# EasyEDA Pro project Atmega328p Shift Register.eprj

# Schematic Schematic1
Board Name: Board1; Create Date: 2025-01-31; Page Name: P1; Project Name: Arduino Nano Shift Register; Schematic Name: Schematic1; Update Date: 2025-01-30; Company: EasyEDA.com; Page Size: A4; Version: V1.0
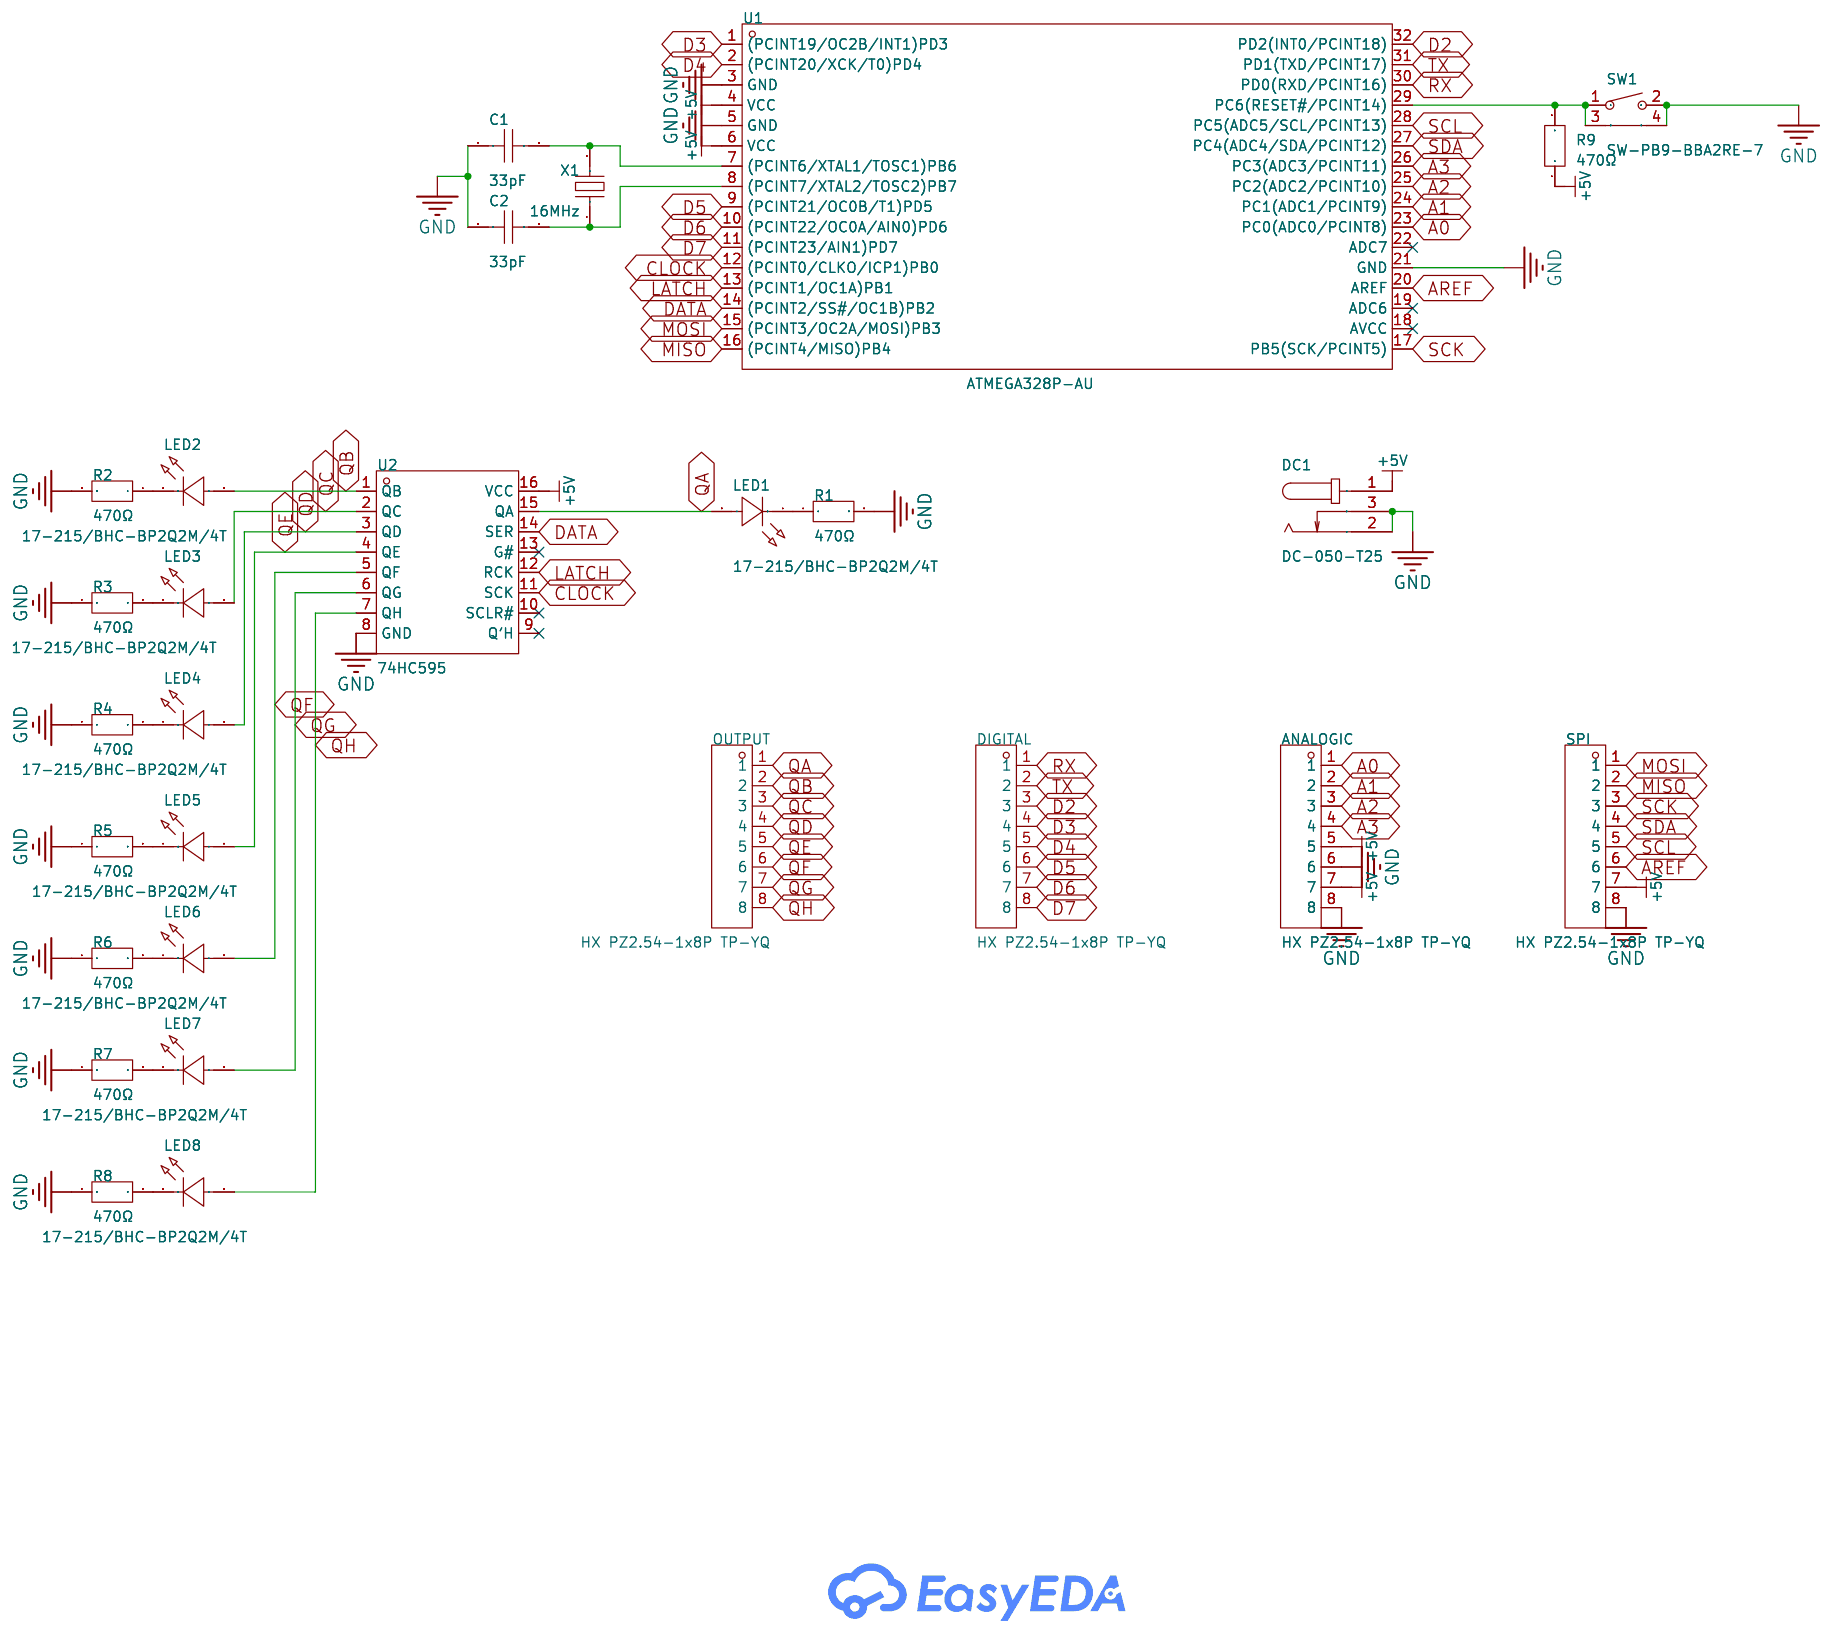
[diagram p0: schematic sheet]

## Parts
ANALOGIC  HX PZ2.54-1x8P TP-YQ  [HDR-SMD_8P-P2.54-V-M-LS4.8_XKB_R1]
C1  33pF  [C0603]
C2  33pF  [C0603]
DC1  DC-050-T25  [DC-IN-SMD_DC-050-T25]
DIGITAL  HX PZ2.54-1x8P TP-YQ  [HDR-SMD_8P-P2.54-V-M-LS4.8_XKB_R1]
LED1  17-215/BHC-BP2Q2M/4T  [LED0805-RD]
LED2  17-215/BHC-BP2Q2M/4T  [LED0805-RD]
LED3  17-215/BHC-BP2Q2M/4T  [LED0805-RD]
LED4  17-215/BHC-BP2Q2M/4T  [LED0805-RD]
LED5  17-215/BHC-BP2Q2M/4T  [LED0805-RD]
LED6  17-215/BHC-BP2Q2M/4T  [LED0805-RD]
LED7  17-215/BHC-BP2Q2M/4T  [LED0805-RD]
LED8  17-215/BHC-BP2Q2M/4T  [LED0805-RD]
OUTPUT  HX PZ2.54-1x8P TP-YQ  [HDR-SMD_8P-P2.54-V-M-LS4.8_XKB_R1]
R1  470Ω  [R0805]
R2  470Ω  [R0805]
R3  470Ω  [R0805]
R4  470Ω  [R0805]
R5  470Ω  [R0805]
R6  470Ω  [R0805]
R7  470Ω  [R0805]
R8  470Ω  [R0805]
R9  470Ω  [R0805]
SPI  HX PZ2.54-1x8P TP-YQ  [HDR-SMD_8P-P2.54-V-M-LS4.8_XKB_R1]
SW1  SW-PB9-BBA2RE-7  [SW-SMD_SW-PB9-BBA2RE-7]
U1  ATMEGA328P-AU  [TQFP-32_L7.0-W7.0-P0.80-LS9.0-BL]
U2  74HC595  [SOP-16_L9.9-W3.9-P1.27-LS6.0-BL]
X1  16MHz  [HC-49S_L7.0-W4.0-LS8.0]

## Library data of the parts
ANALOGIC DIGITAL OUTPUT SPI = HX PZ2.54-1x8P TP-YQ: LCSC Part Name: 1x8P 间距:2.54mm 方针 立贴; Supplier Part: C41417365; Manufacturer: hanxia(韩下); Supplier Footprint: SMD,P=2.54mm(交错脚); Datasheet: https://atta.szlcsc.com/upload/public/pdf/source/20240927/D9736A64A8D4E11D9DE5C9D94414317B.pdf; Supplier: LCSC; Pin Structure: 1x8P; Pitch: 2.54mm; Circluar Pins/Square Pins: Policy; Mounting Type: Standing paste; Number of Rows: Single Row; Number of Pins: 8P; Rated Current: 3A; Length of Mating Pin: 6mm; Insulation Height: 2.5mm; Contact Plating: Gold; Operating Temperature: -40℃~+105℃; Color: Black
C1 C2 = C0603C330J8GAC7867: LCSC Part Name: 33pF ±5% 10V; Supplier Part: C3881472; Manufacturer: KEMET(基美); Supplier Footprint: 0603; JLCPCB Part Class: Extended Part; Datasheet: https://atta.szlcsc.com/upload/public/pdf/source/20231023/C0402C681F5GAC7867-e974561de8c2c410bc948341e1392a66.pdf; Supplier: LCSC; Tolerance: ±5%
DC1 = DC-050-T25: Supplier Part: C113716; Manufacturer: SOFNG(硕方); Supplier Footprint: SMD; Datasheet: https://atta.szlcsc.com/upload/public/pdf/source/20241205/2A515B297B2D6AED9E5FA390EA3E3387.pdf; Supplier: LCSC; Current Rating (Max): 3A; Voltage Rating (Max): 12V
LED1-LED8 = 17-215/BHC-BP2Q2M/4T: Supplier Part: C19192157; Manufacturer: EVERLIGHT(亿光); Supplier Footprint: 0805; JLCPCB Part Class: Extended Part; Supplier: LCSC; Illumination Color: Blue; Power(Watts): 95mW; Wavelength - Dominant: 467.5nm~473.5nm; Lens Color: Colorless Transparent Lens; Luminous Intensity: 57mcd~112mcd; Viewing Angle: 130°; Operating Temperature: -40℃~+85℃
R1-R9 = RC2012F471CS: LCSC Part Name: 厚膜电阻 470Ω ±1% 125mW; Supplier Part: C4190682; Manufacturer: SAMSUNG(三星); Supplier Footprint: 0805; JLCPCB Part Class: Extended Part; Datasheet: https://atta.szlcsc.com/upload/public/pdf/source/20210602/455D0E07AED06E76D0C921B8CB06E528.pdf; Supplier: LCSC; Type: Thick Film Resistors; Tolerance: ±1%; Temperature Coefficient: ±100ppm/℃; Operating Temperature: -55℃~+155℃
SW1 = SW-PB9-BBA2RE-7: Supplier Part: C6241509; Manufacturer: ADAM TECH; JLCPCB Part Class: Extended Part; Datasheet: https://atta.szlcsc.com/upload/public/pdf/source/20240419/E6DD6FA39A8FB5D62685F946C05F7AED.pdf; Supplier: LCSC
U1 = ATMEGA328P-AU_C14877: LCSC Part Name: 基于AVR增强型RISC架构的低功耗CMOS 8位微控制器; Supplier Part: C14877; Manufacturer: MICROCHIP(美国微芯); Supplier Footprint: TQFP-32(7x7); JLCPCB Part Class: Extended Part; Datasheet: https://atta.szlcsc.com/upload/public/pdf/source/20140621/1457707095197.pdf; Supplier: LCSC; CPU Core: AVR; Program Storage Size: 32KB; RAM Size: 2KB; GPIO Ports Number: 23; Operating Voltage Range: 1.8V~5.5V; CPU Maximum Speed: 20MHz; Program Memory Type: FLASH; EEPROM: 1KB; Operating Temperature Range: -40℃~+85℃; ADC (Bit): 10bit; Peripheral/Function: WDT；PWM；WDT；PWM; Watchdog: 有; Low-Voltage Detect: 有; Internal Oscillator: 有
U2 = 74HC595: Supplier Part: C18164493; Manufacturer: GR(国睿); Supplier Footprint: SOP-16; Datasheet: https://atta.szlcsc.com/upload/public/pdf/source/20230915/F264A7C02E418D1689E15579DAA93EB8.pdf; Supplier: LCSC; Function: Serial to serial or parallel; Supply Voltage: 2V~6V; Number of Elements: 1; Number of Bits per Element: 8; Output Type: Tri-State; Operating Temperature: -40℃~+85℃
X1 = S47SMD16.000M20PF30R30B3: LCSC Part Name: 16MHz ±30ppm 20pF; Supplier Part: C5346053; Manufacturer: SST(索斯特); Supplier Footprint: HC-49S-SMD-2P-Mini; JLCPCB Part Class: Extended Part; Datasheet: https://atta.szlcsc.com/upload/public/pdf/source/20230109/A4011D3E1F907E361CA04A1A81E186AD.pdf; Supplier: LCSC; Normal temperature Frequency Tolerance: ±30ppm; Load Capacitance: 20pF; Frequency Stability: ±30ppm

## Nets
+5V: ANALOGIC.5 ANALOGIC.7 DC1.1 R9.1 SPI.7 U1.4(VCC) U1.6(VCC) U2.16(VCC)
GND: ANALOGIC.6 ANALOGIC.8 C1.1 C2.1 DC1.2 DC1.3 R1.2 R2.2 R3.1 R4.1 R5.1 R6.1 R7.1 R8.1 SPI.8 SW1.2 SW1.4(EP) U1.3(GND) U1.5(GND) U1.21(GND) U2.8(GND)
A0: ANALOGIC.1 U1.23(PC0(ADC0/PCINT8))
A1: ANALOGIC.2 U1.24(PC1(ADC1/PCINT9))
A2: ANALOGIC.3 U1.25(PC2(ADC2/PCINT10))
A3: ANALOGIC.4 U1.26(PC3(ADC3/PCINT11))
AREF: SPI.6 U1.20(AREF)
CLOCK: U1.12((PCINT0/CLKO/ICP1)PB0) U2.11(SCK)
D2: DIGITAL.3 U1.32(PD2(INT0/PCINT18))
D3: DIGITAL.4 U1.1((PCINT19/OC2B/INT1)PD3)
D4: DIGITAL.5 U1.2((PCINT20/XCK/T0)PD4)
D5: DIGITAL.6 U1.9((PCINT21/OC0B/T1)PD5)
D6: DIGITAL.7 U1.10((PCINT22/OC0A/AIN0)PD6)
D7: DIGITAL.8 U1.11((PCINT23/AIN1)PD7)
DATA: U1.14((PCINT2/SS#/OC1B)PB2) U2.14(SER)
LATCH: U1.13((PCINT1/OC1A)PB1) U2.12(RCK)
MISO: SPI.2 U1.16((PCINT4/MISO)PB4)
MOSI: SPI.1 U1.15((PCINT3/OC2A/MOSI)PB3)
QA: LED1.2(A) OUTPUT.1 U2.15(QA)
QB: LED2.2(A) OUTPUT.2 U2.1(QB)
QC: LED3.2(A) OUTPUT.3 U2.2(QC)
QD: LED4.2(A) OUTPUT.4 U2.3(QD)
QE: LED5.2(A) OUTPUT.5 U2.4(QE)
QF: LED6.2(A) OUTPUT.6 U2.5(QF)
QG: LED7.2(A) OUTPUT.7 U2.6(QG)
QH: LED8.2(A) OUTPUT.8 U2.7(QH)
RX: DIGITAL.1 U1.30(PD0(RXD/PCINT16))
SCK: SPI.3 U1.17(PB5(SCK/PCINT5))
SCL: SPI.5 U1.28(PC5(ADC5/SCL/PCINT13))
SDA: SPI.4 U1.27(PC4(ADC4/SDA/PCINT12))
TX: DIGITAL.2 U1.31(PD1(TXD/PCINT17))
Net-(C1-2): C1.2 U1.7((PCINT6/XTAL1/TOSC1)PB6) X1.2
Net-(C2-2): C2.2 U1.8((PCINT7/XTAL2/TOSC2)PB7) X1.1
Net-(LED1-1): LED1.1(C) R1.1
Net-(LED2-1): LED2.1(C) R2.1
Net-(LED3-1): LED3.1(C) R3.2
Net-(LED4-1): LED4.1(C) R4.2
Net-(LED5-1): LED5.1(C) R5.2
Net-(LED6-1): LED6.1(C) R6.2
Net-(LED7-1): LED7.1(C) R7.2
Net-(LED8-1): LED8.1(C) R8.2
Net-(R9-2): R9.2 SW1.1 SW1.3(EP) U1.29(PC6(RESET#/PCINT14))

Not connected (* = marked no-connect by the designer): U1 18(AVCC)* 19(ADC6)* 22(ADC7)*; U2 9(Q′H)* 10(SCLR#)* 13(G#)*

# Board PCB2
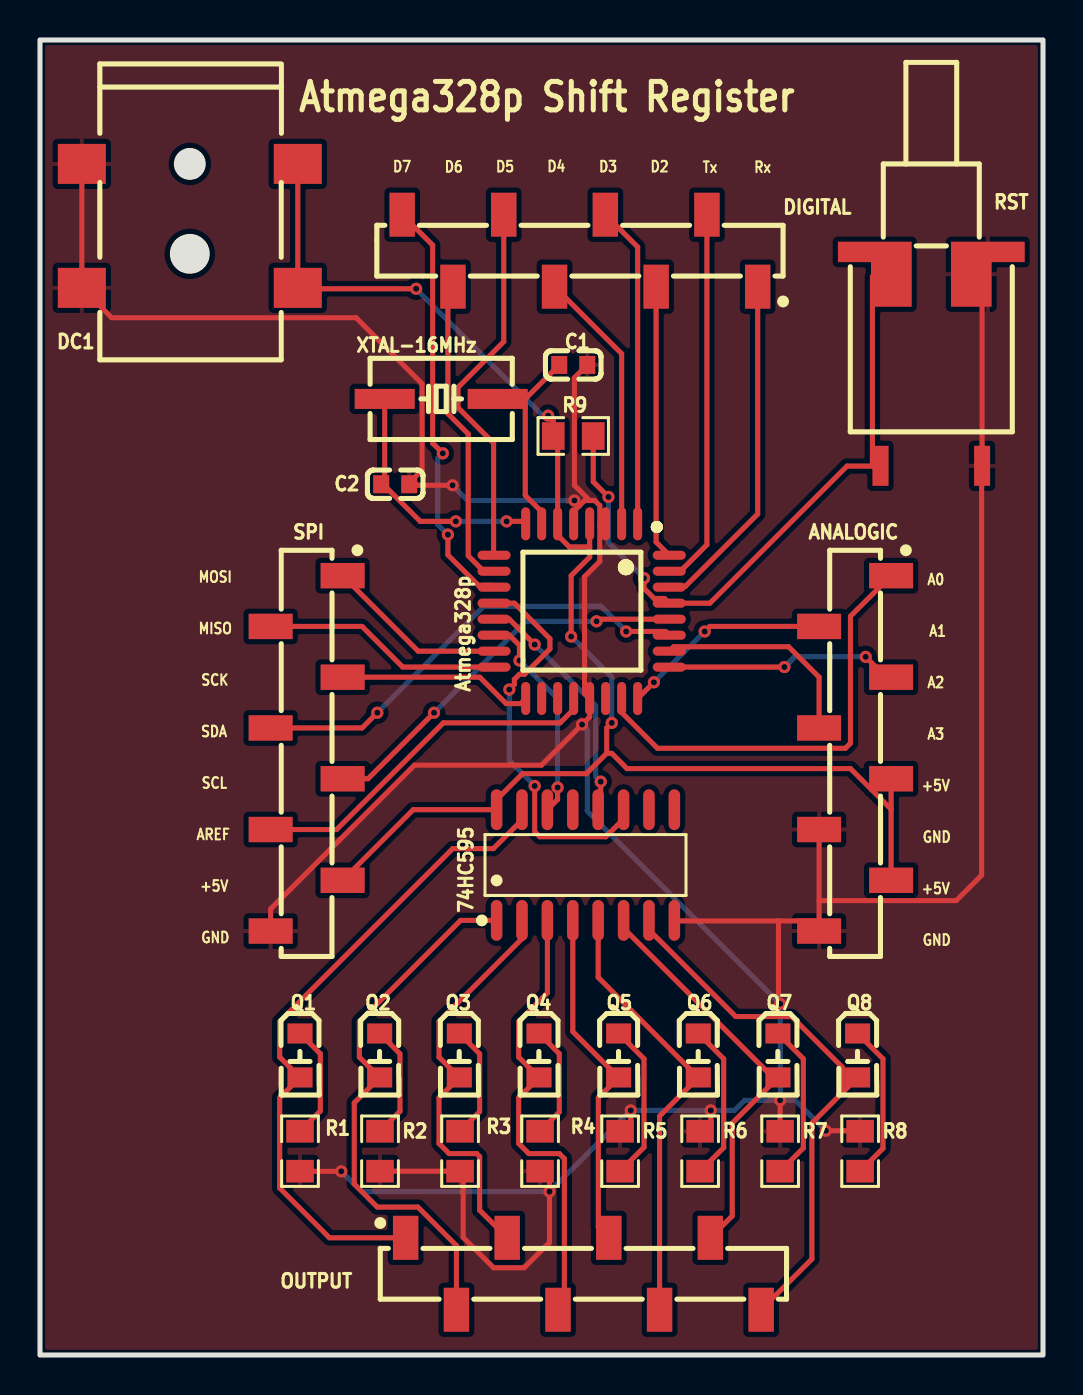
[diagram p1: board, top side]
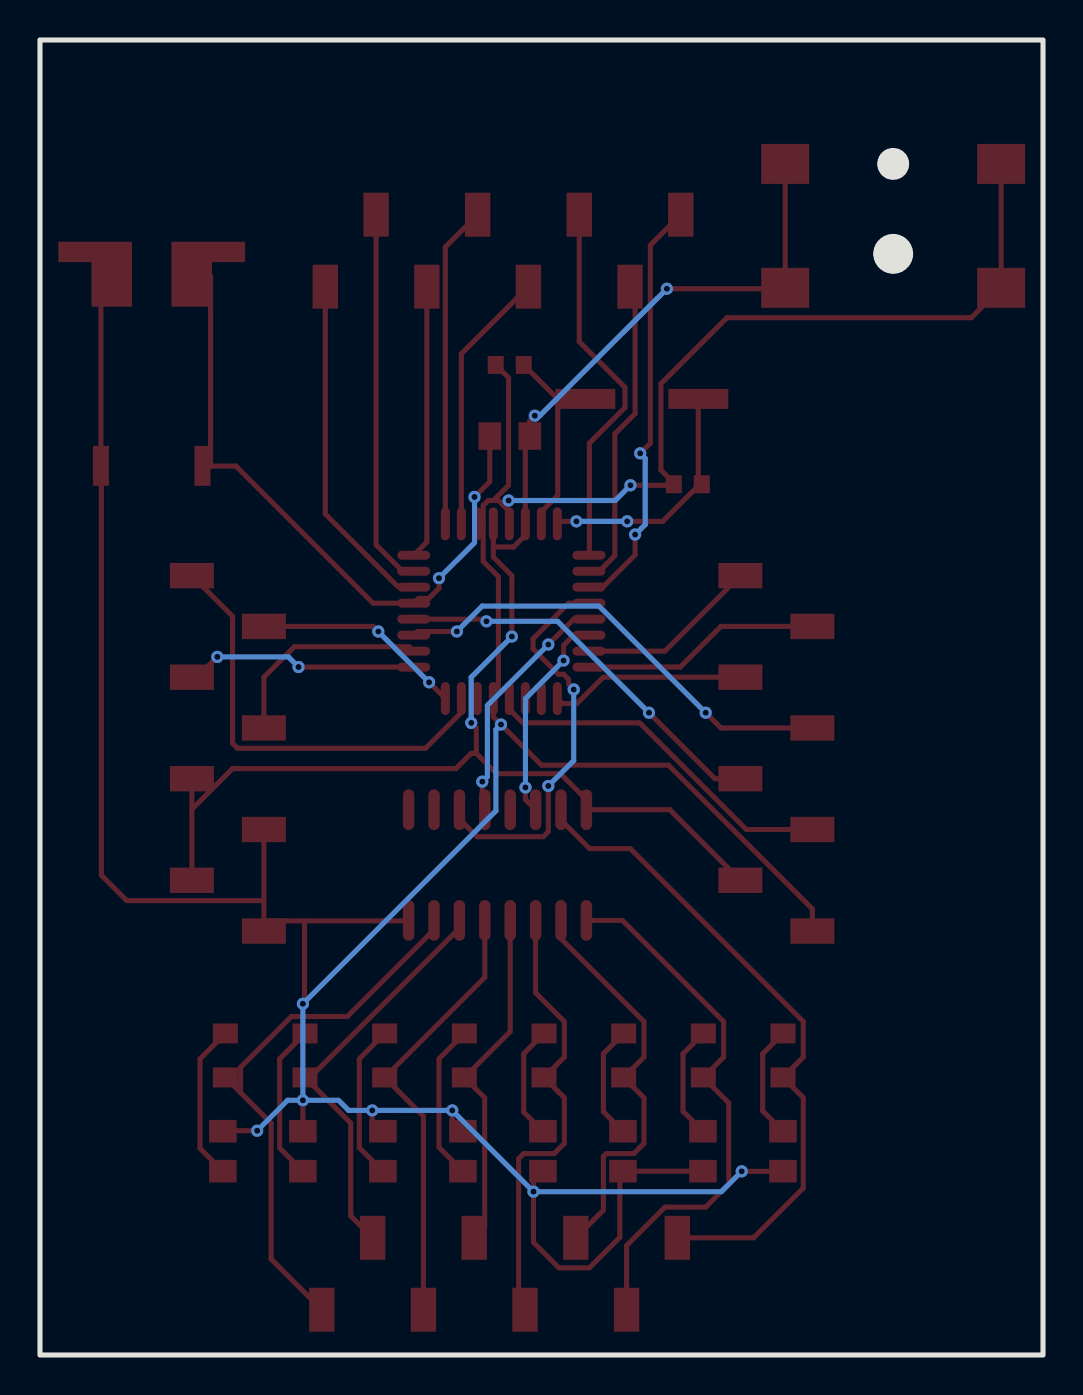
[diagram p2: board, bottom side, seen from below]

Outline 50.16 x 65.79 mm; copper layers: Top Layer, Bottom Layer. Coordinates in mm from the lower left corner of the outline.
Outline path: rectangle 0,65.79 50.16,0
Stack: Top Layer 0.035mm / Dielectric1 1.51mm FR4 er 4.5 / Bottom Layer 0.035mm

## Design rules (mm)
template: JLCPCB Capability(Two Layers Board)
spacing copperThickness1oz (default): track to track 0.102, other pairs 0.152 to 0.3
spacing copperThickness2oz: track to track 0.203, other pairs 0.152 to 0.3
track width copperThickness1oz (default): min 0.127, default 0.254, max 2.54
track width copperThickness2oz: min 0.203, default 0.254, max 2.54
differential pair differentialPair (default): width min 0.127, default 0.254, max 2.54; gap min 0.152, default 0.152
via viaSize (default): diameter min 0.5, default 0.61, max 10; hole min 0.3, default 0.305, max 6.3

## Placement (name value [footprint] x y rotation side)
74HC595  74HC595  [SOP-16_L9.9-W3.9-P1.27-LS6.0-BL]  27.28 24.51 0 top
ANALOGIC  HX PZ2.54-1x8P TP-YQ  [HDR-SMD_8P-P2.54-V-M-LS4.8_XKB_R1]  40.77 30.1 270 top
Atmega328p  ATMEGA328P-AU  [TQFP-32_L7.0-W7.0-P0.80-LS9.0-BL]  27.09 37.21 180 top
C1  33pF  [C0603]  26.67 49.53 180 top
C2  33pF  [C0603]  17.77 43.56 180 top
DC1  DC-050-T25  [DC-IN-SMD_DC-050-T25]  7.49 56.49 90 top
DIGITAL  HX PZ2.54-1x8P TP-YQ  [HDR-SMD_8P-P2.54-V-M-LS4.8_XKB_R1]  27 55.25 180 top
OUTPUT  HX PZ2.54-1x8P TP-YQ  [HDR-SMD_8P-P2.54-V-M-LS4.8_XKB_R1]  27.18 4.06 0 top
Q1  17-215/BHC-BP2Q2M/4T  [LED0805-RD]  13 14.99 270 top
Q2  17-215/BHC-BP2Q2M/4T  [LED0805-RD]  16.99 14.99 270 top
Q3  17-215/BHC-BP2Q2M/4T  [LED0805-RD]  20.97 14.99 270 top
Q4  17-215/BHC-BP2Q2M/4T  [LED0805-RD]  24.96 14.99 270 top
Q5  17-215/BHC-BP2Q2M/4T  [LED0805-RD]  28.94 14.99 270 top
Q6  17-215/BHC-BP2Q2M/4T  [LED0805-RD]  32.92 14.99 270 top
Q7  17-215/BHC-BP2Q2M/4T  [LED0805-RD]  36.91 14.99 270 top
Q8  17-215/BHC-BP2Q2M/4T  [LED0805-RD]  40.89 14.99 270 top
R1  470Ω  [R0805]  13 10.2 270 top
R2  470Ω  [R0805]  17.01 10.2 270 top
R3  470Ω  [R0805]  21.01 10.2 90 top
R4  470Ω  [R0805]  25.01 10.2 90 top
R5  470Ω  [R0805]  29.01 10.2 270 top
R6  470Ω  [R0805]  33.01 10.2 270 top
R7  470Ω  [R0805]  37.02 10.2 270 top
R8  470Ω  [R0805]  41.02 10.2 270 top
R9  470Ω  [R0805]  26.67 45.97 0 top
RST  SW-PB9-BBA2RE-7  [SW-SMD_SW-PB9-BBA2RE-7]  44.58 49.28 270 top
SPI  HX PZ2.54-1x8P TP-YQ  [HDR-SMD_8P-P2.54-V-M-LS4.8_XKB_R1]  13.34 30.1 270 top
XTAL-16MHz  16MHz  [HC-49S_L7.0-W4.0-LS8.0]  20.07 47.83 0 top

## Footprints (pads in the part's own frame, mm; a bottom-side part is the same pattern mirrored in y, then rotated)
C0603
  rect 0.8x0.9 smd: 1(-0.7,0) 2(0.7,0)
DC-IN-SMD_DC-050-T25
  rect 2x2.4 smd: 1(-3.1,-5.4) 1(3.1,-5.4) 2(3.1,5.4) 3(-3.1,5.4)
HC-49S_L7.0-W4.0-LS8.0
  rect 3x1 smd: 1(-2.825,0) 2(2.825,0)
HDR-SMD_8P-P2.54-V-M-LS4.8_XKB_R1
  rect 1.27x2.2 smd: 1(-8.89,1.8) 2(-6.35,-1.8) 3(-3.81,1.8) 4(-1.27,-1.8) 5(1.27,1.8) 6(3.81,-1.8) 7(6.35,1.8) 8(8.89,-1.8)
LED0805-RD
  rect 1x1.25 smd: 1(-1.1,0) 2(1.1,0)
R0805
  rect 1.133x1.377 smd: 1(-1,0) 2(1,0)
SOP-16_L9.9-W3.9-P1.27-LS6.0-BL
  oval 0.574x2.038 smd: 1(-4.445,-2.769) 2(-3.175,-2.769) 3(-1.905,-2.769) 4(-0.635,-2.769) 5(0.635,-2.769) 6(1.905,-2.769) 7(3.175,-2.769) 8(4.445,-2.769) 9(4.445,2.769) 10(3.175,2.769) 11(1.905,2.769) 12(0.635,2.769) 13(-0.635,2.769) 14(-1.905,2.769) 15(-3.175,2.769) 16(-4.445,2.769)
SW-SMD_SW-PB9-BBA2RE-7
  rect 2x0.8 smd: 1(4.793,-2.539) 2(4.793,2.541)
  custom 3.25x3.685 smd: 3(-4.793,-2.827) 4(-4.793,2.827)
TQFP-32_L7.0-W7.0-P0.80-LS9.0-BL
  oval 0.45x1.65 smd: 1(-2.8,-4.369) 2(-2,-4.369) 3(-1.2,-4.369) 4(-0.4,-4.369) 5(0.4,-4.369) 6(1.2,-4.369) 7(2,-4.369) 8(2.8,-4.369) 17(2.8,4.369) 18(2,4.369) 19(1.2,4.369) 20(0.4,4.369) 21(-0.4,4.369) 22(-1.2,4.369) 23(-2,4.369) 24(-2.8,4.369)
  oval 1.65x0.45 smd: 9(4.381,-2.8) 10(4.381,-2) 11(4.381,-1.2) 12(4.381,-0.4) 13(4.381,0.4) 14(4.381,1.2) 15(4.381,2) 16(4.381,2.8) 25(-4.381,2.8) 26(-4.381,2) 27(-4.381,1.2) 28(-4.381,0.4) 29(-4.381,-0.4) 30(-4.381,-1.2) 31(-4.381,-2) 32(-4.381,-2.8)

## Nets
+5V: 74HC595.16 ANALOGIC.5 ANALOGIC.7 Atmega328p.4 Atmega328p.6 DC1.1 R9.1 SPI.7
GND: 74HC595.8 ANALOGIC.6 ANALOGIC.8 Atmega328p.3 Atmega328p.5 Atmega328p.21 C1.1 C2.1 DC1.2 DC1.3 R1.2 R2.2 R3.1 R4.1 R5.1 R6.1 R7.1 R8.1 RST.2 RST.4 SPI.8
A0: ANALOGIC.1 Atmega328p.23
A1: ANALOGIC.2 Atmega328p.24
A2: ANALOGIC.3 Atmega328p.25
A3: ANALOGIC.4 Atmega328p.26
AREF: Atmega328p.20 SPI.6
CLOCK: 74HC595.11 Atmega328p.12
D2: Atmega328p.32 DIGITAL.3
D3: Atmega328p.1 DIGITAL.4
D4: Atmega328p.2 DIGITAL.5
D5: Atmega328p.9 DIGITAL.6
D6: Atmega328p.10 DIGITAL.7
D7: Atmega328p.11 DIGITAL.8
DATA: 74HC595.14 Atmega328p.14
LATCH: 74HC595.12 Atmega328p.13
MISO: Atmega328p.16 SPI.2
MOSI: Atmega328p.15 SPI.1
QA: 74HC595.15 OUTPUT.1 Q1.2
QB: 74HC595.1 OUTPUT.2 Q2.2
QC: 74HC595.2 OUTPUT.3 Q3.2
QD: 74HC595.3 OUTPUT.4 Q4.2
QE: 74HC595.4 OUTPUT.5 Q5.2
QF: 74HC595.5 OUTPUT.6 Q6.2
QG: 74HC595.6 OUTPUT.7 Q7.2
QH: 74HC595.7 OUTPUT.8 Q8.2
RX: Atmega328p.30 DIGITAL.1
SCK: Atmega328p.17 SPI.3
SCL: Atmega328p.28 SPI.5
SDA: Atmega328p.27 SPI.4
TX: Atmega328p.31 DIGITAL.2
$1N1594: Atmega328p.7 C1.2 XTAL-16MHz.2
$1N1605: Atmega328p.8 C2.2 XTAL-16MHz.1
$1N1751: Atmega328p.29 R9.2 RST.1 RST.3
$1N2318: Q1.1 R1.1
$1N2320: Q2.1 R2.1
$1N2333: Q3.1 R3.2
$1N2335: Q4.1 R4.2
$1N2354: Q5.1 R5.2
$1N2365: Q6.1 R6.2
$1N2376: Q7.1 R7.2
$1N2378: Q8.1 R8.2

Pads without a net: 74HC595 9 10 13; Atmega328p 18 19 22

## Via types
v1: diameter 0.61, hole 0.305, Top Layer to Bottom Layer, 34 vias

## Routing (per net, layer and track width the routed paths; a pad name or vN(x,y) marks a point on that pad's centre or on a via; arc(x,y) is an arc through that point)
+5V: length 78.8
  Top Layer w0.254: v1(25.42,46.99) 25.67,46.74 R9.1 25.89,45.75 Atmega328p.6 25.97,41.5 25.97,40.93 26.48,40.42 27.49,40.42 ; v1(28.6,31.62) 28.34,31.37 28.34,30.1 ; 27.49,40.42 27.49,39.92 26.56,38.99 v1(26.56,35.94) ; 27.49,40.42 Atmega328p.4 ; SPI.7 18.67,27.28 74HC595.16 22.84,27.79 24.13,29.08 27.33,29.08 28.34,30.1 ; 42.57,27.3 40.53,29.34 29.36,29.34 28.6,30.1 28.34,30.1 ; 42.57,27.3 ANALOGIC.5 ; 42.57,27.3 ANALOGIC.7 ; DC1.1 DC1.1 12.94,53.34 v1(18.81,53.34)
  Bottom Layer w0.254: v1(25.42,46.99) 25.16,46.99 v1(18.81,53.34) ; v1(28.6,31.62) 28.6,33.91 v1(26.56,35.94)
GND: length 211.3
  Top Layer w0.254: v1(39.3,11.22) 40.99,11.22 R8.1 ; 36.94,21.72 36.94,17.65 v1(37.02,17.57) ; 36.94,21.72 38.97,21.72 ; 36.94,21.72 31.75,21.72 74HC595.8 ; 38.97,21.72 38.97,22.73 ; 38.97,21.72 ANALOGIC.8 ; C2.1 18.6,43.7 18.6,43.76 ; 38.97,22.73 45.82,22.73 47.09,24 47.09,44.46 RST.2 47.12,53.78 RST.4 ; 38.97,22.73 ANALOGIC.6 ; 18.6,43.76 18.86,43.51 v1(20.63,43.51) ; 18.6,43.76 19.11,44.27 19.11,48.59 15.81,51.89 3.59,51.89 DC1.3 DC1.2 ; 27.49,42.75 27.75,42.75 28,42.49 28,41.48 ; 27.49,42.75 26.73,43.51 26.73,48.89 C1.1 ; 27.49,42.75 27.24,42.75 26.98,42.49 ; 28,41.48 28.19,41.48 Atmega328p.3 ; 28,41.48 28,39.7 27.24,38.94 27.24,33.1 Atmega328p.21 27.49,31.92 v1(27.11,31.54) 25.08,29.51 18.73,29.51 11.53,22.31 SPI.8 ; R2.2 R3.1 21.16,9.04 21.16,5.89 22.69,4.36 24.21,4.36 25.48,5.63 v1(25.48,8.17) 25.48,8.72 R4.1 ; v1(33.55,12.24) 33.55,11.73 R6.1 ; v1(37.02,12.75) R7.1 ; Atmega328p.5 26.69,42.2 26.98,42.49 ; R5.1 29.55,11.73 v1(29.55,12.24) ; v1(15.07,9.19) 13.01,9.19 ; 26.98,42.49 v1(26.73,42.75)
  Bottom Layer w0.254: v1(15.07,9.19) 16.08,8.17 v1(25.48,8.17) v1(29.55,12.24) v1(33.55,12.24) 34.73,12.24 35.24,12.75 v1(37.02,12.75) ; v1(27.11,31.54) 27.37,31.29 27.37,27.22 v1(37.02,17.57) v1(37.02,12.75) ; v1(37.02,12.75) 37.78,12.75 v1(39.3,11.22) ; v1(26.73,42.75) 21.4,42.75 v1(20.63,43.51)
A0: length 22.2
  Top Layer w0.254: Atmega328p.23 29.09,32.14 30.88,30.35 40.28,30.35 40.53,30.61 40.53,36.96 ANALOGIC.1
A1: length 10.6
  Top Layer w0.254: v1(33.24,36.19) 33.5,36.45 ANALOGIC.2 ; v1(30.7,33.66) Atmega328p.24
  Bottom Layer w0.254: v1(33.24,36.19) v1(30.7,33.66)
A2: length 11.7
  Top Layer w0.254: v1(41.3,34.92) 42.31,33.91 ANALOGIC.3 ; v1(37.23,34.42) 31.48,34.42
  Bottom Layer w0.254: v1(41.3,34.92) 37.74,34.92 v1(37.23,34.42)
A3: length 10.8
  Top Layer w0.254: ANALOGIC.4 38.97,33.91 37.44,35.43 31.69,35.43 Atmega328p.26
AREF: length 18.2
  Top Layer w0.254: SPI.6 14.84,26.29 20.17,31.62 26.01,31.62 26.69,32.3 Atmega328p.20
CLOCK: length 20.1
  Top Layer w0.254: v1(24.74,28.47) 24.74,26.18 25,25.93 28.3,25.93 29.19,26.82 74HC595.11 ; Atmega328p.12 23.73,37.61 25.5,35.83 25.5,35.33 24.23,34.05 23.98,34.05 23.73,33.8 23.73,33.55 v1(23.47,33.29)
  Bottom Layer w0.254: v1(24.74,28.47) 23.47,29.74 v1(23.47,33.29)
D2: length 13.7
  Top Layer w0.254: Atmega328p.32 30.81,40.67 DIGITAL.3
D3: length 16.1
  Top Layer w0.254: Atmega328p.1 29.89,55.43 DIGITAL.4
D4: length 13.3
  Top Layer w0.254: DIGITAL.5 29.09,50.09 Atmega328p.2
D5: length 18.7
  Top Layer w0.254: DIGITAL.6 23.19,50.69 20.91,48.41 20.91,47.39 22.69,45.61 22.69,40.03 Atmega328p.9
D6: length 15.6
  Top Layer w0.254: DIGITAL.7 20.4,53.19 20.4,47.09 21.42,46.08 21.42,39.98 22.19,39.21 Atmega328p.10
D7: length 21.2
  Top Layer w0.254: v1(20.4,41.04) 20.4,40.03 21.93,38.5 22.62,38.5 Atmega328p.11 ; v1(20.15,45.11) 19.64,45.61 19.64,55.52 DIGITAL.8
  Bottom Layer w0.254: v1(20.4,41.04) 19.89,41.55 19.89,44.85 v1(20.15,45.11)
DATA: length 10.7
  Top Layer w0.254: v1(25.89,28.39) 25.89,27.79 74HC595.14 ; v1(23.98,34.74) 23.98,35.5 23.47,36.01 Atmega328p.14
  Bottom Layer w0.254: v1(23.98,34.74) 25.89,32.84 v1(25.89,28.39)
LATCH: length 12.2
  Top Layer w0.254: Atmega328p.13 23.47,36.81 v1(24.74,35.54) ; 74HC595.12 28.04,27.41 v1(28.04,28.68)
  Bottom Layer w0.254: v1(28.04,28.68) 27.79,28.94 27.79,32.49 v1(24.74,35.54)
MISO: length 12
  Top Layer w0.254: 22.7,34.42 18.14,34.42 16.11,36.45 SPI.2
MOSI: length 9.1
  Top Layer w0.254: SPI.1 18.91,35.21 Atmega328p.15
QA: length 33.3
  Top Layer w0.254: 74HC595.15 24.11,26.77 22.68,25.33 20.64,25.33 11.99,16.68 11.99,14.9 13,13.89 11.99,12.87 11.99,8.35 14.48,5.86 18.29,5.86
QB: length 27.6
  Top Layer w0.254: 74HC595.1 21.03,21.74 15.97,16.68 15.97,14.9 16.99,13.89 15.72,12.62 15.72,8.55 16.87,7.4 18.9,7.4 20.83,5.47 20.83,2.26
QC: length 20.7
  Top Layer w0.254: OUTPUT.3 21.99,7.24 21.99,9.93 21.84,10.08 20.46,10.08 19.96,10.58 19.96,12.87 20.97,13.89 19.96,14.9 19.96,16.68 24.11,20.83 74HC595.2
QD: length 22.9
  Top Layer w0.254: 25.91,2.26 26.23,2.58 26.23,9.82 25.97,10.08 24.45,10.08 23.94,10.58 23.94,12.87 24.96,13.89 23.94,14.9 23.94,16.68 25.38,18.12 74HC595.3
QE: length 17.5
  Top Layer w0.254: 74HC595.4 26.65,16.18 28.94,13.89 27.92,12.87 27.92,6.39 OUTPUT.5
QF: length 22.4
  Top Layer w0.254: 74HC595.5 27.92,18.89 32.92,13.89 30.99,11.95 30.99,2.26
QG: length 20.6
  Top Layer w0.254: 74HC595.6 29.29,21.64 29.29,21.25 36.65,13.89 36.91,13.89 34.62,11.6 34.62,6.96 OUTPUT.7
QH: length 27.9
  Top Layer w0.254: 40.89,13.89 40.13,13.12 ; 40.13,13.12 40.13,14.39 37.59,16.93 34.8,16.93 30.48,21.25 30.48,21.72 74HC595.7 ; 40.13,13.12 38.61,11.6 38.61,4.8 36.07,2.26
RX: length 17.3
  Top Layer w0.254: DIGITAL.1 35.9,42.07 32.28,38.46 31.52,38.46 Atmega328p.30
SCK: length 9.8
  Top Layer w0.254: SPI.3 21.99,33.91 23.31,32.59 24.04,32.59 Atmega328p.17
SCL: length 19.6
  Top Layer w0.254: v1(19.71,32.13) 16.41,28.83 SPI.5 ; v1(27.84,36.7) 27.94,36.81 Atmega328p.28
  Bottom Layer w0.254: v1(19.71,32.13) 24.28,36.7 v1(27.84,36.7)
SDA: length 23.1
  Top Layer w0.254: Atmega328p.27 31.29,36.19 v1(29.31,36.19) ; v1(16.87,32.13) 16.11,31.37 SPI.4
  Bottom Layer w0.254: v1(29.31,36.19) 28.04,37.47 22.2,37.47 v1(16.87,32.13)
TX: length 18.9
  Top Layer w0.254: Atmega328p.31 32.03,39.21 33.35,40.53 DIGITAL.2
$1N1594: length 10.4
  Top Layer w0.254: 24.27,47.83 24.27,43 25.03,42.24 25.03,41.64 Atmega328p.7 ; 24.27,47.83 C1.2 ; 24.27,47.83 XTAL-16MHz.2
$1N1605: length 12.4
  Top Layer w0.254: 17.24,43.74 XTAL-16MHz.1 ; 17.24,43.74 C2.2 ; 17.24,43.74 17.24,43.48 19.02,41.7 v1(20.8,41.7) ; Atmega328p.8 24.17,41.7 v1(23.34,41.7)
  Bottom Layer w0.254: v1(20.8,41.7) v1(23.34,41.7)
$1N1751: length 33.3
  Top Layer w0.254: v1(30.21,38.86) 30.21,38.35 30.72,37.85 31.24,37.85 Atmega328p.29 33.5,37.61 40.36,44.47 41.63,44.47 ; 41.63,44.47 42.02,44.47 RST.1 ; 41.63,44.47 41.63,53.95 RST.3 ; R9.2 27.67,43.69 v1(28.43,42.93)
  Bottom Layer w0.254: v1(30.21,38.86) 28.43,40.64 v1(28.43,42.93)
$1N2318: length 5.7
  Top Layer w0.254: Q1.1 14.02,15.07 14.02,12.21 R1.1
$1N2320: length 5.7
  Top Layer w0.254: R2.1 18,12.19 18,15.07 Q2.1
$1N2333: length 5.7
  Top Layer w0.254: R3.2 21.99,12.17 21.99,15.07 Q3.1
$1N2335: length 5.7
  Top Layer w0.254: Q4.1 25.97,15.07 25.97,12.16 R4.2
$1N2354: length 7.9
  Top Layer w0.254: Q5.1 30.21,14.82 30.21,10.39 R5.2
$1N2365: length 7.9
  Top Layer w0.254: R6.2 34.19,10.38 34.19,14.82 Q6.1
$1N2376: length 7.9
  Top Layer w0.254: R7.2 38.18,10.36 38.18,14.82 Q7.1
$1N2378: length 7.9
  Top Layer w0.254: Q8.1 42.16,14.82 42.16,10.34 R8.2

## Copper pours and planes (outline as drawn; the poured copper is in the pictures)
GND on Top Layer: -4.19,68.45 58.29,68.45 58.29,-6.35 -4.19,-6.35

## Text on the board
Top Silkscreen Layer: AREF | MOSI | MISO | +5V | SDA | SCK | GND | SCL | A0 | A2 | A3 | A1 | D7 | D6 | D5 | D4 | D3 | D2 | Tx | Rx | Atmega328p Shift Register
